# EAGLE schematic sensor (EAGLE 9.5.2)
DATE: Spring'20; REVISION: 1; SCH_DESC: Measures current; Outputs to Teensy or USB; TEAM: RoboWrestling; TITLE: Current Sensing Board
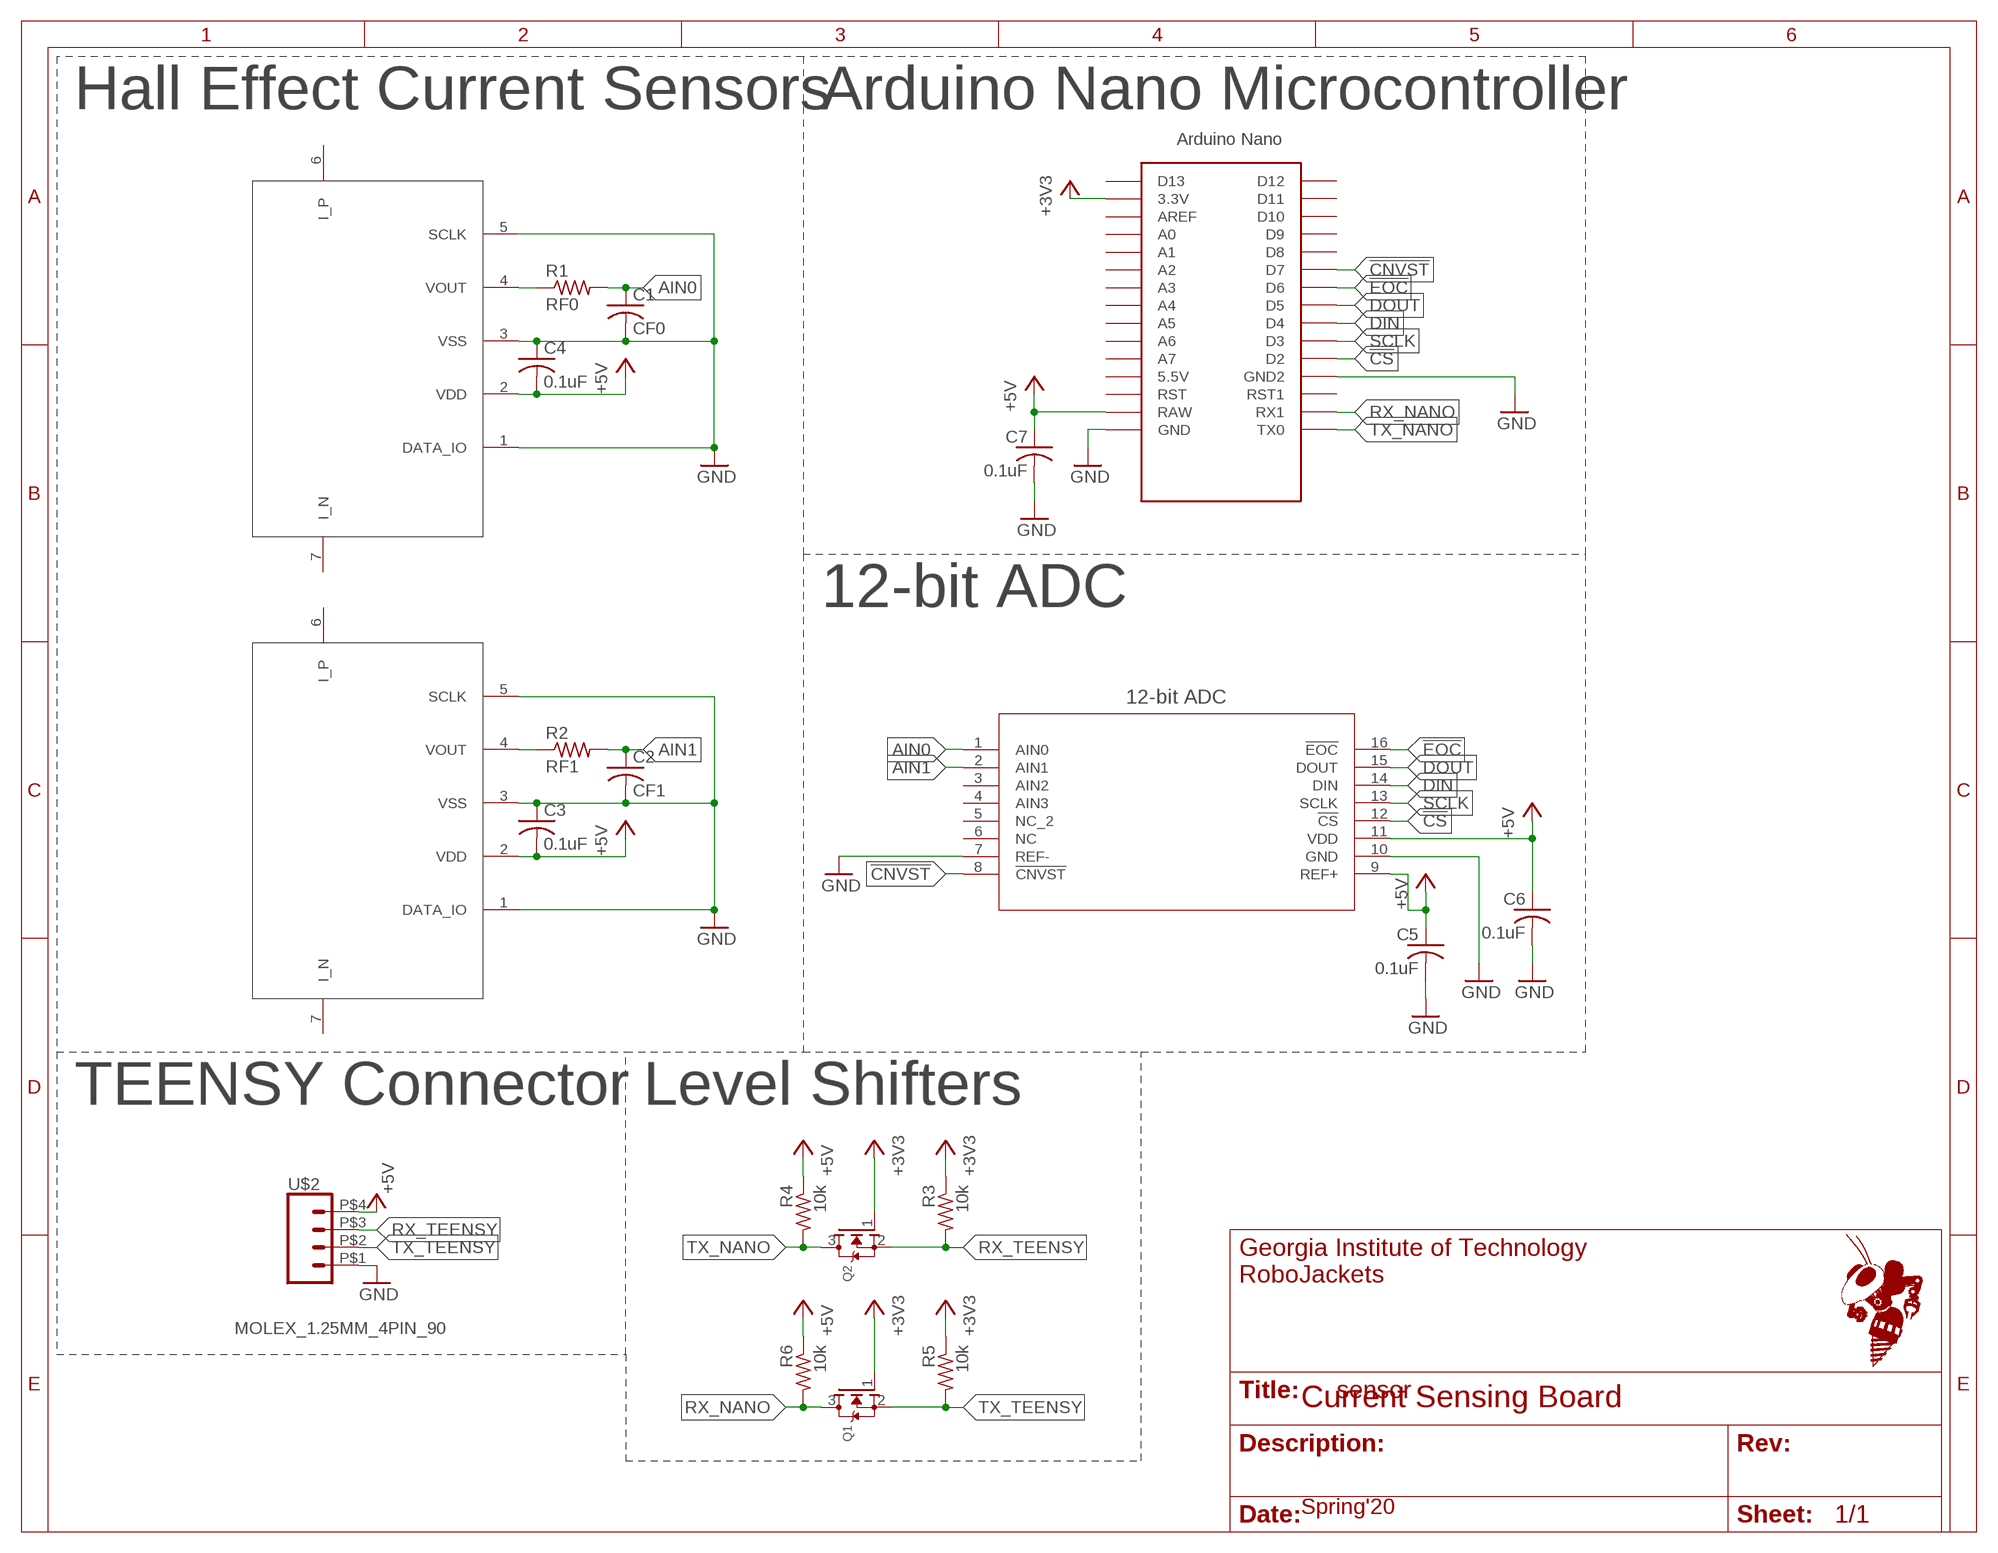
[diagram p0: schematic, sheet 1]

## Parts
12-BIT_ADC  MAX11634EEE+T21-0055H_16-L  [21-0055H_16-L]
C1  CF0  C-USC0603  [C0603]
C2  CF1  C-USC0603  [C0603]
C3  0.1uF  C-USC0603  [C0603]
C4  0.1uF  C-USC0603  [C0603]
C5  0.1uF  C-USC0603  [C0603]
C6  0.1uF  C-USC0603  [C0603]
C7  0.1uF  C-USC0603  [C0603]
Q1  ADAFRUIT_MOSFET-NREFLOW  [ADAFRUIT_SOT23]
Q2  ADAFRUIT_MOSFET-NREFLOW  [ADAFRUIT_SOT23]
R1  RF0  R-US_R0603  [R0603]
R2  RF1  R-US_R0603  [R0603]
R3  10k  R-US_R0603  [R0603]
R4  10k  R-US_R0603  [R0603]
R5  10k  R-US_R0603  [R0603]
R6  10k  R-US_R0603  [R0603]
SENSOR_0  CQ2065  [CQ2065]
SENSOR_1  CQ2065  [CQ2065]
U$1  NANO  [NANO]
U$2  MOLEX_1.25MM_4PIN_90  [MOLEX_1.25MM_4PIN_90]

## Nets
!CNVST!: 12-BIT_ADC.8(!CNVST) U$1.D7
!CS!: 12-BIT_ADC.12(!CS) U$1.D2
!EOC!: 12-BIT_ADC.16(!EOC) U$1.D6
+3V3: Q1.1(G) Q2.1(G) R3.1 R5.1 U$1.3.3V
+5V: 12-BIT_ADC.9(REF+) 12-BIT_ADC.11(VDD) C3.2 C4.2 C5.1 C6.1 C7.1 R4.1 R6.1 SENSOR_0.2(VDD) SENSOR_1.2(VDD) U$1.GND(RAW) U$2.P$4
AIN0: 12-BIT_ADC.1(AIN0) C1.1 R1.2
AIN1: 12-BIT_ADC.2(AIN1) C2.1 R2.2
DIN: 12-BIT_ADC.14(DIN) U$1.D4
DOUT: 12-BIT_ADC.15(DOUT) U$1.D5
GND: 12-BIT_ADC.7(REF-) 12-BIT_ADC.10(GND) C1.2 C2.2 C3.1 C4.1 C5.2 C6.2 C7.2 SENSOR_0.1(DATA_IO) SENSOR_0.3(VSS) SENSOR_0.5(SCLK) SENSOR_1.1(DATA_IO) SENSOR_1.3(VSS) SENSOR_1.5(SCLK) U$1.GND1(GND2) U$1.RAW(GND) U$2.P$1
N$3: R2.1 SENSOR_1.4(VOUT)
N$5: R1.1 SENSOR_0.4(VOUT)
RX_NANO: Q1.3(D) R6.2 U$1.RX1
RX_TEENSY: Q2.2(S) R3.2 U$2.P$3
SCLK: 12-BIT_ADC.13(SCLK) U$1.D3
TX_NANO: Q2.3(D) R4.2 U$1.TX0
TX_TEENSY: Q1.2(S) R5.2 U$2.P$2
Unconnected: 12-BIT_ADC.3(AIN2) 12-BIT_ADC.4(AIN3) 12-BIT_ADC.5(NC_2) 12-BIT_ADC.6(NC) SENSOR_0.6(I_P) SENSOR_0.7(I_N) SENSOR_1.6(I_P) SENSOR_1.7(I_N) U$1.5V(5.5V) U$1.A0 U$1.A1 U$1.A2 U$1.A3 U$1.A4 U$1.A5 U$1.A6 U$1.A7 U$1.AREF U$1.D8 U$1.D9 U$1.D10 U$1.D11 U$1.D12 U$1.D13 U$1.ICSP1 U$1.ICSP2 U$1.ICSP3 U$1.ICSP4 U$1.ICSP5 U$1.ICSP6 U$1.RST U$1.RST1

## Notes on the sheet
- Hall Effect Current Sensors | Arduino Nano Microcontroller
- 12-bit ADC
- TEENSY Connector | Level Shifters

## Library data of the parts
12-BIT_ADC = CurrentSensing:MAX11634EEE+T; BUILT_BY: EMA_UL_Team; MANUFACTURER_PART_NUMBER: MAX11634EEE+T; VENDOR: Maxim Integrated Products
C1-C7 = rcl:C-US: CAPACITOR, American symbol; SPICEPREFIX: C
Q1 Q2 = Adafruit FET 4-Channel Shifter:ADAFRUIT_MOSFET-N: N-Channel Mosfet 2N7002E - 60V 260mA SOT23 [Digikey: 2N7002ET1GOSTR-ND] - REEL BSH103 - 30V 850mA SOT23 [Digikey: 568-5013-1-ND]
R1-R6 = rcl:R-US_: RESISTOR, American symbol; SPICEPREFIX: R
SENSOR_0 SENSOR_1 = CurrentSensing:CQ2065
U$1 = I'mRADIOactive:NANO: Arduino Nano
U$2 = Kirbi_ControlBoard:MOLEX_1.25MM_4PIN_90